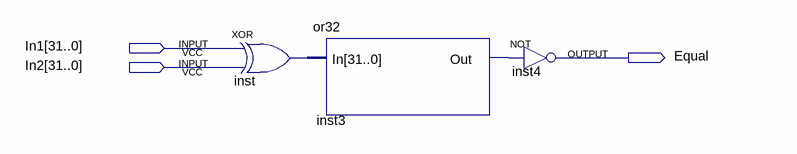
[diagram p0: schematic sheet]
// Quartus schematic Equal32.bdf as structural Verilog: 3 symbols, 3 pins
module Equal32 (
  input  [31:0] In1,
  input  [31:0] In2,
  output Equal
);

  wire inst3_out;
  wire [31:0] inst_out;

  assign inst_out = In1 ^ In2;  // XOR inst, 32 bits wide
  or32 inst3 (.In(inst_out), .Out(inst3_out));
  not inst4 (Equal, inst3_out);
endmodule
